# EAGLE design Multiplex_candle_SqBRDV5 (EAGLE 5.06)
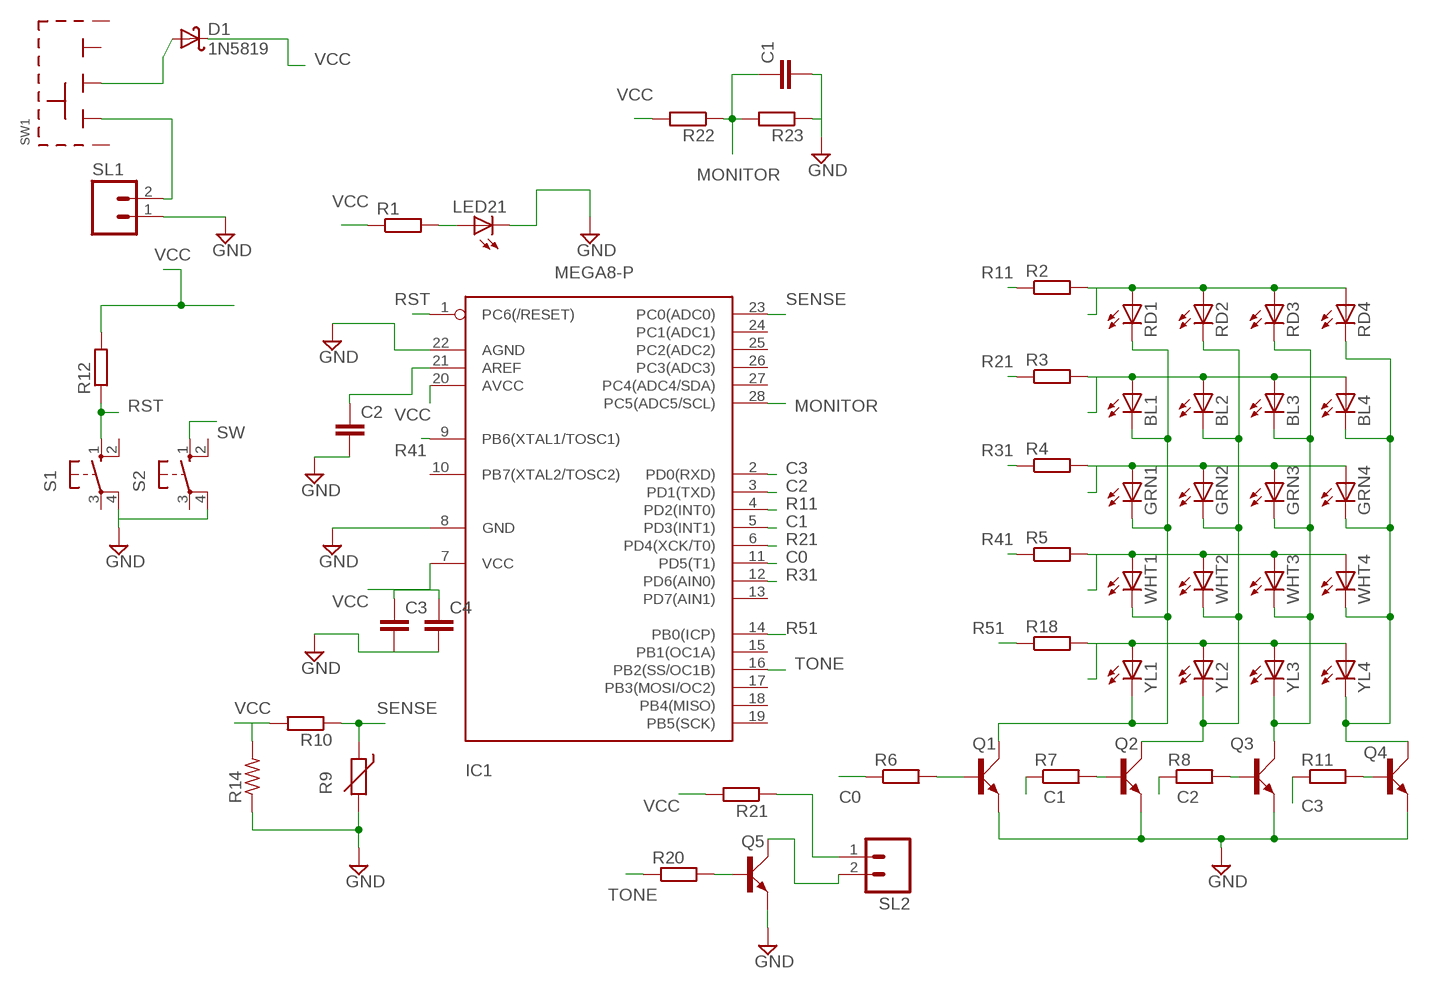
[diagram p0: schematic, sheet 1]

## Parts
BL1  LED3MM  [LED3MM]
BL2  LED3MM  [LED3MM]
BL3  LED3MM  [LED3MM]
BL4  LED3MM  [LED3MM]
C1  C2.5/2  [C2.5-2]
C2  C2.5/2  [C2.5-2]
C3  C2.5/2  [C2.5-2]
C4  C2.5/2  [C2.5-2]
D1  1N5819  [DO41-10]
GRN1  LED3MM  [LED3MM]
GRN2  LED3MM  [LED3MM]
GRN3  LED3MM  [LED3MM]
GRN4  LED3MM  [LED3MM]
IC1  MEGA8-P  [DIL28-3]
LED21  LED3MM  [LED3MM]
Q1  BD139  [TO126AV]
Q2  BD139  [TO126AV]
Q3  BD139  [TO126AV]
Q4  BD139  [TO126AV]
Q5  BD139  [TO126AV]
R1  R-EU_0204/7  [0204/7]
R2  R-EU_0207/10  [0207/10]
R3  R-EU_0207/10  [0207/10]
R4  R-EU_0207/10  [0207/10]
R5  R-EU_0207/10  [0207/10]
R6  R-EU_0207/10  [0207/10]
R7  R-EU_0207/10  [0207/10]
R8  R-EU_0207/10  [0207/10]
R9  THERMISTOR-2,5  [RS-2,5]
R10  R-EU_0204/7  [0204/7]
R11  R-EU_0207/10  [0207/10]
R12  R-EU_0207/12  [0207/12]
R14  R-US_0309/12  [0309/12]
R18  R-EU_0207/10  [0207/10]
R20  R-EU_0204/7  [0204/7]
R21  R-EU_0207/12  [0207/12]
R22  R-EU_0204/7  [0204/7]
R23  R-EU_0204/7  [0204/7]
RD1  LED3MM  [LED3MM]
RD2  LED3MM  [LED3MM]
RD3  LED3MM  [LED3MM]
RD4  LED3MM  [LED3MM]
S1  10-XX  [B3F-10XX]
S2  10-XX  [B3F-10XX]
SL1  M02  [02P]
SL2  M02  [02P]
SW1  SLIDESWITCHBIG  [BIGSWITCH]
WHT1  LED3MM  [LED3MM]
WHT2  LED3MM  [LED3MM]
WHT3  LED3MM  [LED3MM]
WHT4  LED3MM  [LED3MM]
YL1  LED3MM  [LED3MM]
YL2  LED3MM  [LED3MM]
YL3  LED3MM  [LED3MM]
YL4  LED3MM  [LED3MM]

## Nets
C0: IC1.11(PD5(T1)) R6.1
C1: IC1.5(PD3(INT1)) R7.1
C2: IC1.3(PD1(TXD)) R8.1
C3: IC1.2(PD0(RXD)) R11.1
GND: C1.2 C2.2 C3.2 C4.2 IC1.8(GND) IC1.22(AGND) LED21.K(C) Q1.E Q2.E Q3.E Q4.E Q5.E R9.2 R14.1 R23.1 S1.4(P1) S2.4(P1) SL1.1
MONITOR: C1.1 IC1.28(PC5(ADC5/SCL)) R22.1 R23.2
N$1: R2.2 RD1.A RD2.A RD3.A RD4.A
N$2: BL1.A BL2.A BL3.A BL4.A R3.2
N$3: GRN1.A GRN2.A GRN3.A GRN4.A R4.2
N$4: R5.2 WHT1.A WHT2.A WHT3.A WHT4.A
N$5: R18.2 YL1.A YL2.A YL3.A YL4.A
N$6: BL1.K(C) GRN1.K(C) Q1.C RD1.K(C) WHT1.K(C) YL1.K(C)
N$7: C2.1 IC1.21(AREF)
N$8: BL2.K(C) GRN2.K(C) Q2.C RD2.K(C) WHT2.K(C) YL2.K(C)
N$9: BL3.K(C) GRN3.K(C) Q3.C RD3.K(C) WHT3.K(C) YL3.K(C)
N$12: BL4.K(C) GRN4.K(C) Q4.C RD4.K(C) WHT4.K(C) YL4.K(C)
N$13: Q3.B R8.2
N$14: Q1.B R6.2
N$15: Q2.B R7.2
N$16: SL1.2 SW1.1
N$17: Q4.B R11.2
N$20: Q5.B R20.2
N$21: R21.1 SL2.1
N$22: LED21.A R1.2
N$23: D1.A SW1.2
N$24: Q5.C SL2.2
R11: IC1.4(PD2(INT0)) R2.1
R21: IC1.6(PD4(XCK/T0)) R3.1
R31: IC1.12(PD6(AIN0)) R4.1
R41: IC1.9(PB6(XTAL1/TOSC1)) R5.1
R51: IC1.14(PB0(ICP)) R18.1
RST: IC1.1(PC6(/RESET)) R12.1 S1.1(S)
SENSE: IC1.23(PC0(ADC0)) R9.1 R10.1
SW: S2.1(S)
TONE: IC1.16(PB2(SS/OC1B)) R20.1
VCC: C3.1 C4.1 D1.C IC1.7(VCC) IC1.20(AVCC) R1.1 R10.2 R12.2 R14.2 R21.2 R22.2
Unconnected: IC1.10(PB7(XTAL2/TOSC2)) IC1.13(PD7(AIN1)) IC1.15(PB1(OC1A)) IC1.17(PB3(MOSI/OC2)) IC1.18(PB4(MISO)) IC1.19(PB5(SCK)) IC1.24(PC1(ADC1)) IC1.25(PC2(ADC2)) IC1.26(PC3(ADC3)) IC1.27(PC4(ADC4/SDA)) S1.2(S1) S1.3(P) S2.2(S1) S2.3(P) SW1.3 SW1.TAB1 SW1.TAB2

## Library data of the parts
BL1-BL4 GRN1-GRN4 LED21 RD1-RD4 WHT1-WHT4 YL1-YL4 = led:LED: LED OSRAM: - CHIPLED LG R971, LG N971, LY N971, LG Q971, LY Q971, LO R971, LY R971 LH N974, LH R974 LS Q976, LO Q976, LY Q976 LO Q996 - Hyper CHIPLED LW Q18S LB Q993, LB Q99A, LB R99A - SideLED LS A670, LO A670, LY A670, LG A670, LP A670 LB A673, LV A673, LT A673, LW A673 LH A674 LY A675 LS A676, LA A676, LO A676, LY A676, LW A676 LS A679, LY A679, LG A679 - Hyper Micro SIDELED® LS Y876, LA Y876, LO Y876, LY Y876 LT Y87S - SmartLED LW L88C, LW L88S LB L89C, LB L89S, LG L890 LS L89K, LO L89K, LY L89K LS L896, LA L896, LO L896, LY L896 - TOPLED LS T670, LO T670, LY T670, LG T670, LP T670 LSG T670, LSP T670, LSY T670, LOP T670, LYG T670 LG T671, LOG T671, LSG T671 LB T673, LV T673, LT T673, LW T673 LH T674 LS T676, LA T676, LO T676, LY T676, LB T676, LH T676, LSB T676, LW T676 LB T67C, LV T67C, LT T67C, LS T67K, LO T67K, LY T67K, LW E67C LS E67B, LA E67B, LO E67B, LY E67B, LB E67C, LV E67C, LT E67C LW T67C LS T679, LY T679, LG T679 LS T770, LO T770, LY T770, LG T770, LP T770 LB T773, LV T773, LT T773, LW T773 LH T774 LS E675, LA E675, LY E675, LS T675 LS T776, LA T776, LO T776, LY T776, LB T776 LHGB T686 LT T68C, LB T68C - Hyper Mini TOPLED® LB M676 - Mini TOPLED Santana® LG M470 LS M47K, LO M47K, LY M47K Source: http://www.osram.convergy.de - LUMILED® LXK2-PW12-R00, LXK2-PW12-S00, LXK2-PW14-U00, LXK2-PW14-V00 LXK2-PM12-R00, LXK2-PM12-S00, LXK2-PM14-U00 LXK2-PE12-Q00, LXK2-PE12-R00, LXK2-PE12-S00, LXK2-PE14-T00, LXK2-PE14-U00 LXK2-PB12-K00, LXK2-PB12-L00, LXK2-PB12-M00, LXK2-PB14-N00, LXK2-PB14-P00, LXK2-PB14-Q00 LXK2-PR12-L00, LXK2-PR12-M00, LXK2-PR14-Q00, LXK2-PR14-R00 LXK2-PD12-Q00, LXK2-PD12-R00, LXK2-PD12-S00 LXK2-PH12-R00, LXK2-PH12-S00 LXK2-PL12-P00, LXK2-PL12-Q00, LXK2-PL12-R00 Source: www.luxeon.com
C1-C4 = capacitor-wima:C: CAPACITOR naming: grid - package width
D1 = CEDTv10:1N5819: DIODE general purpose rectifier, 1 A
IC1 = atmel:MEGA8-P: MICROCONTROLLER 8 Kbytes FLASH, 1 kbytes SRAM, 512 bytes EEPROM, USART, 4-channel 10 bit ADC, 2-channel 8 bit ADC Pin compatible with Atmega48, ATMega88, ATMega168 Source: avr.lbr
Q1-Q5 = transistor-power:BD139: NPN TRANSISTOR
R1-R8 R10-R12 R18 R20-R23 = resistor:R-EU_: RESISTOR, European symbol
R9 = varistor:THERMISTOR: THERMISTOR
R14 = rcl:R-US_: RESISTOR, American symbol
S1 S2 = switch-omron:10-XX: OMRON SWITCH
SL1 SL2 = con-amp-quick:M02: AMP QUICK CONNECTOR
SW1 = CEDTv110:SLIDESWITCHBIG

## Board
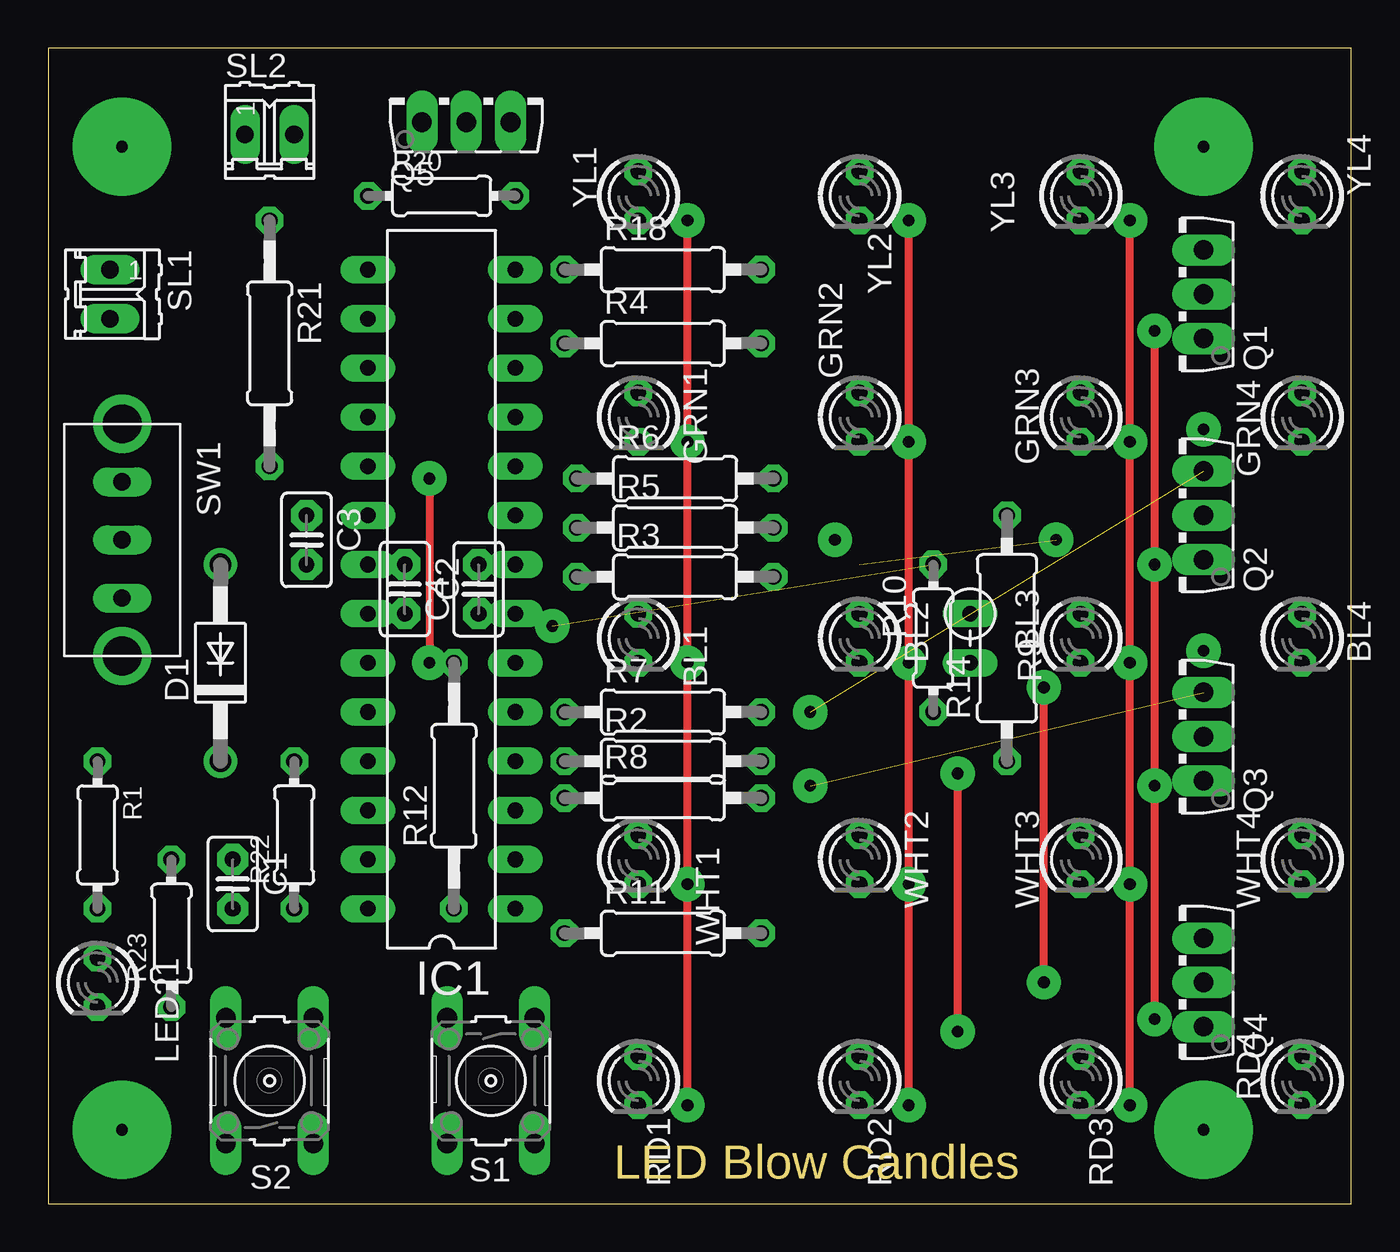
[diagram p1: board, top side]
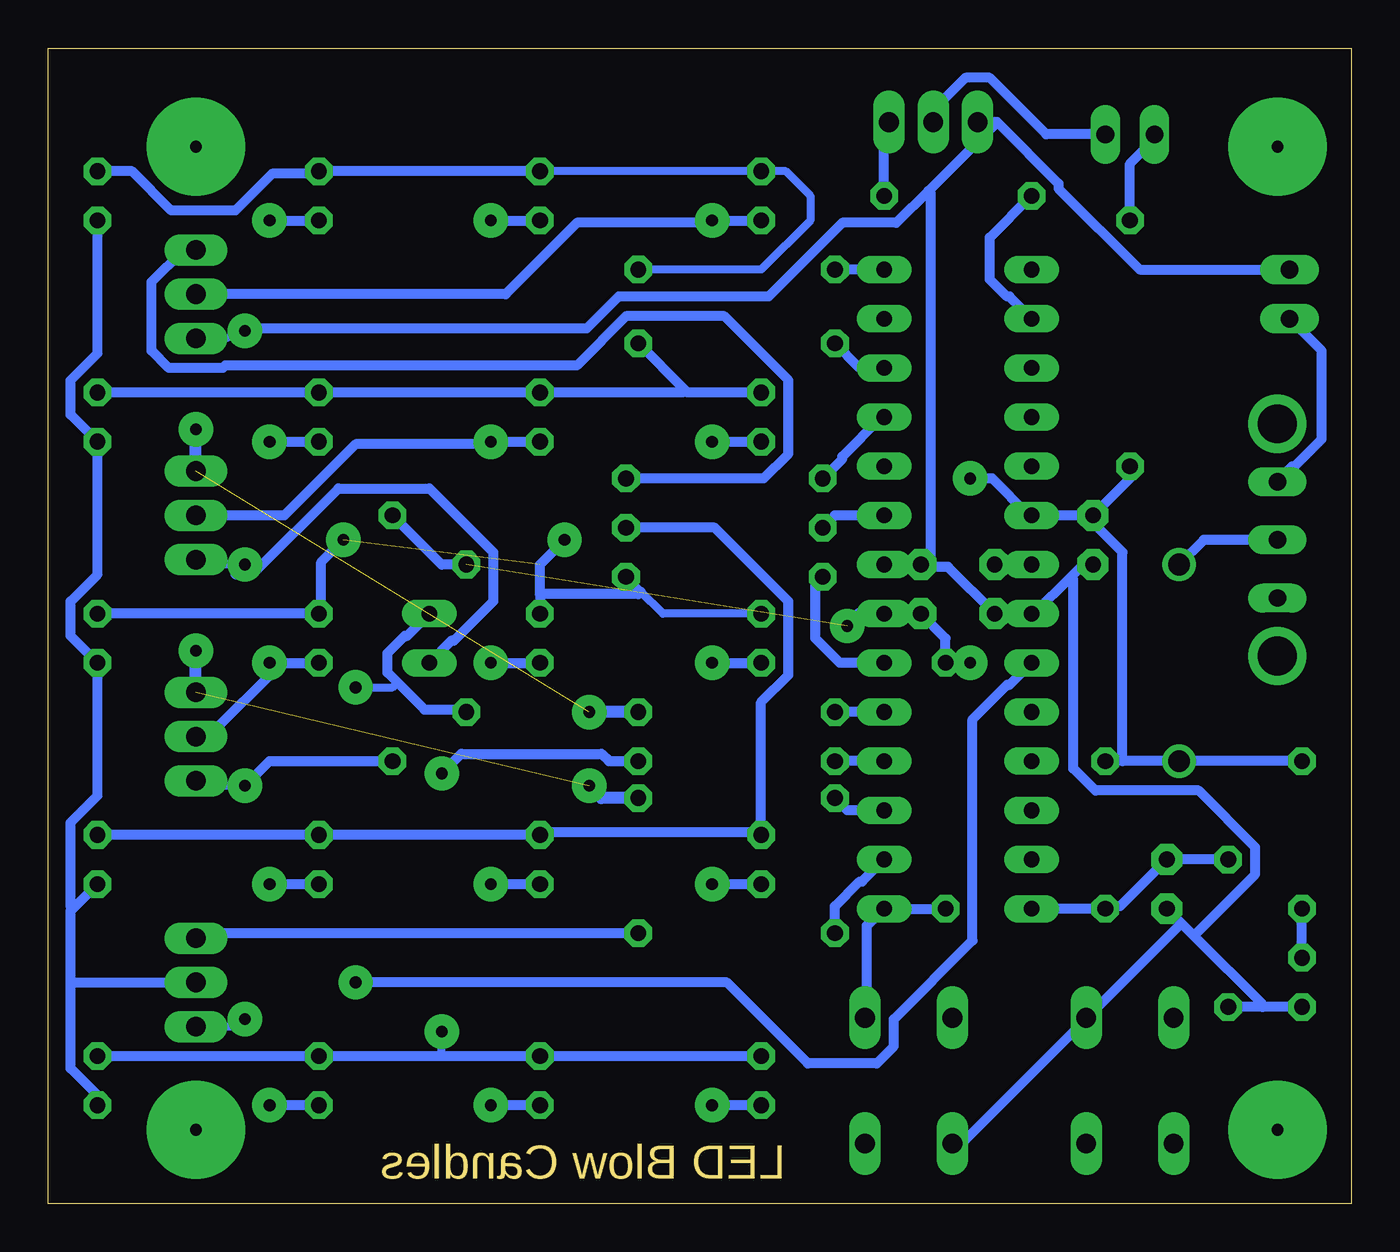
[diagram p2: board, bottom side, seen from below]

Size 67.31 x 59.69 mm. Coordinates in mm from the lower left corner, seen from the top.
Outline: 0,59.69 0,0 67.31,0 67.31,59.69 0,59.69
Copper layers (1*16): Top 0.035mm / dielectric 1.5mm / Bottom 0.035mm
Design rules "default *": minimum track width 20mil, minimum drill 24mil, track to track 16mil, track to pad 16mil, pad to pad 16mil, via to via 16mil, smd to smd 16mil, copper to edge 40mil, drill to drill 20mil, minimum pad ring 12mil, minimum via ring 12mil, stop-mask expansion 4mil, vias tented up to drill 0mil, thermal gap 10mil

### Footprints (pad centres in the part's own frame; a part is rotated, then mirrored left to right if it is on the bottom)
LED3MM = drill 0.813 octagon: A -1.27,0; K 1.27,0
C2.5-2 = drill 0.813 pad 1.6 octagon: 1 -1.27,0; 2 1.27,0
DO41-10 = drill 1.118 round: A 5.08,0; C -5.08,0
DIL28-3 = drill 0.813 long: 1 -16.51,-3.81; 2 -13.97,-3.81; 3 -11.43,-3.81; 4 -8.89,-3.81; 5 -6.35,-3.81; 6 -3.81,-3.81; 7 -1.27,-3.81; 8 1.27,-3.81; 9 3.81,-3.81; 10 6.35,-3.81; 11 8.89,-3.81; 12 11.43,-3.81; 13 13.97,-3.81; 14 16.51,-3.81; 15 16.51,3.81; 16 13.97,3.81; 17 11.43,3.81; 18 8.89,3.81; 19 6.35,3.81; 20 3.81,3.81; 21 1.27,3.81; 22 -1.27,3.81; 23 -3.81,3.81; 24 -6.35,3.81; 25 -8.89,3.81; 26 -11.43,3.81; 27 -13.97,3.81; 28 -16.51,3.81
TO126AV = drill 1.016 long: B 2.286,-1.27; C 0,-1.27; E -2.286,-1.27
0204/7 = drill 0.813 octagon: 1 -3.81,0; 2 3.81,0
0207/10 = drill 0.813 octagon: 1 -5.08,0; 2 5.08,0
RS-2,5 = drill 0.813 long: 1 -1.27,0; 2 1.27,0
0207/12 = drill 0.813 octagon: 1 -6.35,0; 2 6.35,0
0309/12 = drill 0.813 octagon: 1 -6.35,0; 2 6.35,0
B3F-10XX = drill 1.016 long: 1 -3.251,2.261; 2 3.251,2.261; 3 -3.251,-2.261; 4 3.251,-2.261
02P = drill 0.914 long: 1 -1.27,0; 2 1.27,0
BIGSWITCH = drill 0.9 long: 1 -3,0; 2 0,0; 3 3,0 | drill 2 pad 2.184 round: TAB1 -6,0; TAB2 6,0

### Placement (x,y rotation side)
BL1  30.48,29.21 270 top
BL2  41.91,29.21 270 top
BL3  53.34,29.21 270 top
BL4  64.77,29.21 270 top
C1  9.53,16.51 270 top
C2  18.41,31.75 270 top
C3  13.34,34.29 270 top
C4  22.23,31.75 90 top
D1  8.89,27.94 90 top
GRN1  30.48,40.64 270 top
GRN2  41.91,40.64 270 top
GRN3  53.34,40.64 270 top
GRN4  64.77,40.64 270 top
IC1  20.32,31.75 90 top
LED21  2.54,11.43 270 top
Q1  58.42,46.99 90 top
Q2  58.42,35.56 90 top
Q3  58.42,24.13 90 top
Q4  58.42,11.43 90 top
Q5  21.59,57.15 0 top
R1  2.54,19.05 270 top
R2  31.75,22.86 0 top
R3  32.38,32.38 0 top
R4  31.75,44.45 0 top
R5  32.38,34.92 0 top
R6  32.38,37.47 0 top
R7  31.75,25.4 0 top
R8  31.75,20.95 0 top
R9  47.62,29.21 270 top
R10  45.72,29.21 90 top
R11  31.75,13.97 0 top
R12  20.95,21.59 90 top
R14  49.53,29.21 90 top
R18  31.75,48.26 0 top
R20  20.32,52.07 0 top
R21  11.43,44.45 270 top
R22  12.7,19.05 90 top
R23  6.35,13.97 90 top
RD1  30.48,6.35 270 top
RD2  41.91,6.35 270 top
RD3  53.34,6.35 270 top
RD4  64.77,6.35 270 top
S1  22.86,6.35 270 top
S2  11.43,6.35 90 top
SL1  3.17,46.99 270 top
SL2  11.43,55.24 0 top
SW1  3.81,34.29 270 top
WHT1  30.48,17.78 270 top
WHT2  41.91,17.78 270 top
WHT3  53.34,17.78 270 top
WHT4  64.77,17.78 270 top
YL1  30.48,52.07 270 top
YL2  41.91,52.07 270 top
YL3  53.34,52.07 270 top
YL4  64.77,52.07 270 top

### Tracks (layer width: path | path; a pad name or v marks a point on that pad's centre or on a via)
C0
  Bottom 0.508: R6.1 26.29,38.48 26.29,38.61 24.26,40.64 IC1.11
C1
  Bottom 0.508: IC1.5 R7.1
C2
  Bottom 0.508: IC1.3 26.04,20.32 R8.1
C3
  Bottom 0.508: IC1.2 25.27,16.64 25.4,16.64 26.67,15.37 R11.1
GND  (via drill 0.6 pad 1.78)
  Top 0.406: v57.15,45.09 v57.15,33.02 v57.15,21.59 v57.15,9.53
  Bottom 0.406: Q1.E 58.17,44.7 v57.15,45.09 | v57.15,21.59 58.8,21.59 Q3.E | Q4.E 57.4,9.14 v57.15,9.53 | v57.15,33.02 58.8,33.02 Q2.E 59.69,33.02 v57.15,33.02
  Bottom 0.508: 4.57,10.16 R23.1 | LED21.K 4.57,10.16 | 8.13,13.84 4.57,10.29 4.57,10.16 | 8.13,13.84 8.76,14.48 | 8.76,14.48 C1.2 | 8.76,14.48 13.59,9.65 S2.4 13.84,9.4 20.07,3.17 20.57,3.17 S1.4 | C4.2 IC1.8 | C3.2 13.84,33.02 14.48,32.38 | 14.48,32.38 16.38,30.48 IC1.22 C2.2 20.83,32.89 22.1,32.89 C4.2 | 8.13,13.84 4.95,17.02 4.95,18.41 7.87,21.34 13.21,21.34 14.35,22.48 14.35,32.26 14.48,32.38 | R14.1 55.88,22.86 v57.15,21.59 | R9.2 46.48,29.08 46.35,29.08 44.32,31.11 44.32,33.66 47.62,36.96 52.32,36.96 56.77,32.51 57.66,32.51 v57.15,33.02 | SL1.1 10.92,48.26 15.11,52.45 15.11,52.7 18.29,55.88 | 18.29,55.88 Q5.E | 21.84,52.32 23.5,50.67 26.29,50.67 30.1,46.86 37.85,46.86 39.5,45.21 57.66,45.21 v57.15,45.09 | 21.84,52.32 18.29,55.88 | C4.2 21.72,33.02 21.72,52.2 21.84,52.32
MONITOR
  Bottom 0.508: IC1.28 R22.1 12.57,15.37 11.94,15.37 C1.1 R23.2
N$1  (via drill 0.6 pad 1.78)
  Top 0.406: v46.99,8.89 v46.99,22.23
  Bottom 0.406: 46.99,7.62 v46.99,8.89
  Bottom 0.508: RD1.A RD2.A 46.99,7.62 RD3.A RD4.A | R2.2 38.35,22.86 38.73,23.24 45.97,23.24 v46.99,22.23
N$2  (via drill 0.6 pad 1.78)  (1 unrouted)
  Bottom 0.406: BL1.A 35.56,30.48 36.7,31.62 R3.2
  Bottom 0.508: BL4.A BL3.A 53.21,30.61 53.21,33.15 v52.07,34.29 | 41.91,31.5 41.91,33.02 v40.64,34.29 | 41.91,31.5 BL2.A | 41.91,31.5 36.83,31.5 36.7,31.62
N$3
  Bottom 0.508: GRN1.A 34.29,41.91 34.42,42.04 | 34.42,42.04 R4.2 | 34.42,42.04 34.54,41.91 GRN2.A GRN3.A GRN4.A
N$4
  Bottom 0.508: R5.2 32.89,34.92 29.08,31.11 29.08,27.3 30.48,25.91 WHT1.A 30.61,19.18 41.78,19.18 WHT2.A WHT3.A WHT4.A
N$5
  Bottom 0.406: R18.2 30.48,48.26 27.94,50.8 27.94,52.07 29.21,53.34 YL1.A YL2.A
  Bottom 0.508: YL2.A YL3.A 53.47,53.21 55.75,53.21 57.66,51.31 60.96,51.31 62.99,53.34 YL4.A
N$6  (via drill 0.6 pad 1.78)
  Top 0.406: v33.02,50.8 v33.02,39.37 v33.02,27.94 v33.02,16.51 v33.02,5.08
  Bottom 0.508: Q1.C 43.69,46.99 40.01,50.67 33.15,50.67 v33.02,50.8 YL1.K | RD1.K v33.02,5.08 | v33.02,16.51 WHT1.K | v33.02,27.94 BL1.K | v33.02,39.37 GRN1.K
N$7
  Bottom 0.508: IC1.21 C2.1
N$8  (via drill 0.6 pad 1.78)
  Top 0.406: v44.45,50.8 v44.45,39.37 v44.45,27.94 v44.45,16.51 v44.45,5.08
  Bottom 0.508: Q2.C 55.12,35.56 51.44,39.24 44.58,39.24 v44.45,39.37 GRN2.K | RD2.K v44.45,5.08 | v44.45,16.51 WHT2.K | v44.45,27.94 BL2.K | v44.45,50.8 YL2.K
N$9  (via drill 0.6 pad 1.78)
  Top 0.406: v55.88,5.08 v55.88,16.51 v55.88,27.94 v55.88,39.37 v55.88,50.8
  Bottom 0.508: Q3.C 59.05,24.13 55.37,27.81 v55.88,27.94 BL3.K | RD3.K v55.88,5.08 | v55.88,16.51 WHT3.K | v55.88,39.37 GRN3.K | v55.88,50.8 YL3.K
N$10  (via drill 0.6 pad 5.08)
  other vias: 3.81,54.61
N$11  (via drill 0.6 pad 5.08)
  other vias: 3.81,3.81
N$12
  Bottom 0.508: RD4.K 64.77,5.59 66.17,6.99 66.17,11.43 | 66.17,11.43 66.17,15.11 66.04,15.24 | 66.04,15.24 WHT4.K | 66.04,15.24 66.17,15.37 66.17,19.68 64.77,21.08 BL4.K 66.17,29.34 66.17,31.11 64.77,32.51 GRN4.K 66.17,40.77 66.17,42.55 64.77,43.94 YL4.K | 66.17,11.43 Q4.C
N$13  (via drill 0.6 pad 1.78)  (1 unrouted)
  Bottom 0.61: R8.2 38.73,20.95 v39.37,21.59 | Q3.B v59.69,28.57
N$14
  Bottom 0.508: R6.2 30.35,37.47 29.08,38.73 29.08,42.55 32.38,45.85 37.47,45.85 40.01,43.31 58.17,43.31 58.29,43.18 61.09,43.18 61.98,44.07 61.98,47.62 60.33,49.28 Q1.B
N$15  (via drill 0.6 pad 1.78)  (1 unrouted)
  Bottom 0.61: R7.2 v39.37,25.4 | Q2.B v59.69,40.01
N$16
  Bottom 0.508: SL1.2 1.52,44.07 1.52,39.5 2.92,38.1 3.05,38.1 3.81,37.34 SW1.1
N$17
  Bottom 0.508: R11.2 59.44,13.97 Q4.B
N$18  (via drill 0.6 pad 5.08)
  other vias: 59.69,3.81
N$19  (via drill 0.6 pad 5.08)
  other vias: 59.69,54.61
N$20
  Bottom 0.508: R20.2 24.13,55.63 Q5.B
N$21
  Bottom 0.508: R21.1 11.43,53.72 10.16,54.99 SL2.1
N$22
  Bottom 0.508: LED21.A R1.2
N$23
  Bottom 0.508: SW1.2 7.62,34.29 D1.A
N$24
  Bottom 0.508: SL2.2 15.75,55.24 18.67,58.17 19.94,58.17 21.59,56.52 Q5.C
R11
  Bottom 0.508: IC1.4 R2.1
R21
  Bottom 0.508: IC1.6 26.42,27.94 27.69,29.21 27.69,32 R3.1
R31
  Bottom 0.508: IC1.12 25.4,43.18 R4.1
R41
  Bottom 0.508: IC1.9 26.67,35.56 R5.1
R51
  Bottom 0.508: IC1.14 R18.1
RST
  Bottom 0.508: R12.1 IC1.1 25.02,14.35 25.02,9.65 S1.1
SENSE  (via drill 0.6 pad 1.78)
  Top 0.406: v51.44,11.43 v51.44,26.67
  Bottom 0.406: v51.44,26.67 49.53,26.67 49.28,26.92
  Bottom 0.508: R9.1 48.77,29.34 48.9,29.34 49.78,28.45 49.78,27.43 49.28,26.92 47.88,25.53 45.85,25.53 R10.1 | IC1.23 17.65,26.8 17.78,26.8 19.56,25.02 19.56,13.59 23.62,9.53 23.62,8.13 24.51,7.24 28.07,7.24 32.26,11.43 v51.44,11.43
TONE
  Bottom 0.508: IC1.16 17.65,46.86 17.78,46.86 18.67,47.75 18.67,49.91 R20.1
VCC  (via drill 0.6 pad 1.78)  (1 unrouted)
  Top 0.406: v19.68,37.47 v19.68,27.94
  Bottom 0.406: v19.68,27.94 R12.2
  Bottom 0.508: R21.2 11.43,37.47 C3.1 | C3.1 IC1.20 16.64,35.56 18.54,37.47 v19.68,37.47 | R1.1 D1.C 11.81,22.86 | 11.81,22.86 R22.2 | C3.1 13.21,35.43 13.21,35.05 11.81,33.66 11.81,22.86 | R12.2 20.95,29.21 C4.1 IC1.7 | R10.2 46.99,33.02 R14.2
  Bottom 0.61: IC1.7 25.4,30.48 v26.04,29.84

### Text on the board
Dimension: LED Blow Candles